# EasyEDA Pro project ProPrj_girlday5_2026-02-15.epro

# Schematic Schematic2
Board Name: SimonSays2; Create Date: 2026-01-21; Page Name: P1; Project Name: girlday5; Schematic Name: Schematic2; Update Date: 2026-01-21; Company: EasyEDA.com; Page Size: A4; Version: V1.0
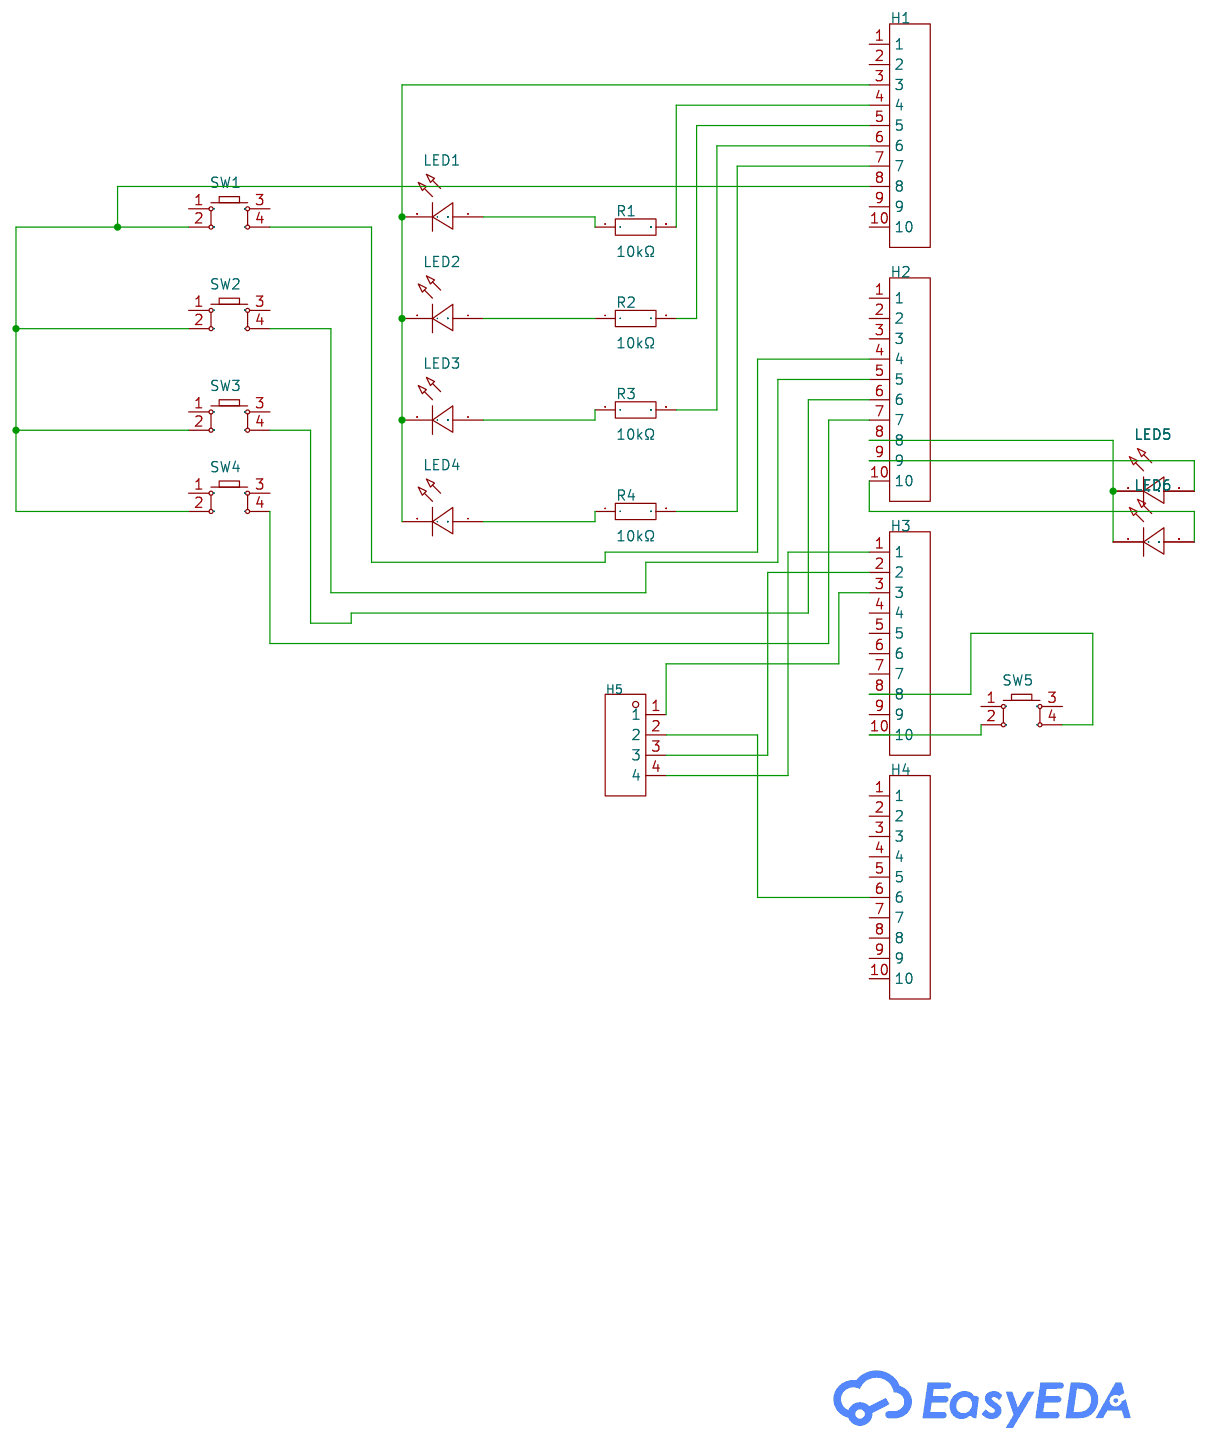
[diagram p0: schematic sheet]

## Parts
H1  -  [HDR-TH_10P-P2.54-V-F]
H2  -  [HDR-TH_10P-P2.54-V-F]
H3  -  [HDR-TH_10P-P2.54-V-F]
H4  -  [HDR-TH_10P-P2.54-V-F]
H5  -  [HDR-TH_4P-P2.54-V-F]
LED1  -  [LED-TH_BD5.8-P2.54-FD]
LED2  -  [LED-TH_BD5.8-P2.54-FD]
LED3  -  [LED-TH_BD5.8-P2.54-FD]
LED4  -  [LED-TH_BD5.8-P2.54-FD]
LED5  -  [LED-TH_BD5.8-P2.54-RD]
LED6  -  [LED-TH_BD5.8-P2.54-RD]
R1  10kΩ  [R_AXIAL-0.4]
R2  10kΩ  [R_AXIAL-0.4]
R3  10kΩ  [R_AXIAL-0.4]
R4  10kΩ  [R_AXIAL-0.4]
SW1  -  [KEY-TH_4P-L6.0-W6.0-P3.90-LS6.5]
SW2  -  [KEY-TH_4P-L6.0-W6.0-P3.90-LS6.5]
SW3  -  [KEY-TH_4P-L6.0-W6.0-P3.90-LS6.5]
SW4  -  [KEY-TH_4P-L6.0-W6.0-P3.90-LS6.5]
SW5  -  [KEY-TH_4P-L6.0-W6.0-P3.90-LS6.5]

## Library data of the parts
H1-H4 = HDR-F_2.54_1x10P: Supplier Footprint: Through
H5 = HDR-F_2.54_1x4P: Supplier Footprint: Through
LED1-LED4 = LED_TH-R_5mm: Supplier Footprint: Through
LED5 LED6 = LED_TH-G_5mm: Supplier Footprint: Through
R1-R4 = Res_AXIAL-1/4W: Supplier Footprint: Through
SW1-SW5 = Key_TH_6x6x4.5: Supplier Footprint: Through

## Nets
$1N1515: LED1.1(C) R1.1
$1N1520: LED2.1(C) R2.1
$1N1525: LED3.1(C) R3.1
$1N1531: LED4.1(C) R4.1
$1N1537: H1.4 R1.2
$1N1543: H1.5 R2.2
$1N1550: H1.6 R3.2
$1N1557: H1.7 R4.2
$1N1576: H2.5 SW2.4
$1N1601: H2.7 SW4.4
$1N1611: H2.4 SW1.4
$1N1619: H2.6 SW3.4
$1N1721: H3.3 H5.1
$1N1740: H3.1 H5.4
$1N1747: H3.2 H5.3
$1N1754: H2.8 LED5.2(A) LED6.2(A)
$1N1761: H2.9 LED5.1(C)
$1N1767: H2.10 LED6.1(C)
$1N1774: H3.10 SW5.2
$1N1779: H3.8 SW5.4
$1N1795: H1.3 LED1.2(A) LED2.2(A) LED3.2(A) LED4.2(A)
$1N2060: H4.6 H5.2
$1N2069: H1.8 SW1.2 SW2.2 SW3.2 SW4.2

Not connected (* = marked no-connect by the designer): H1 1 2 9 10; H2 1 2 3; H3 4 5 6 7 9; H4 1 2 3 4 5 7 8 9 10; SW1 1 3; SW2 1 3; SW3 1 3; SW4 1 3; SW5 1 3

# Board PCB4
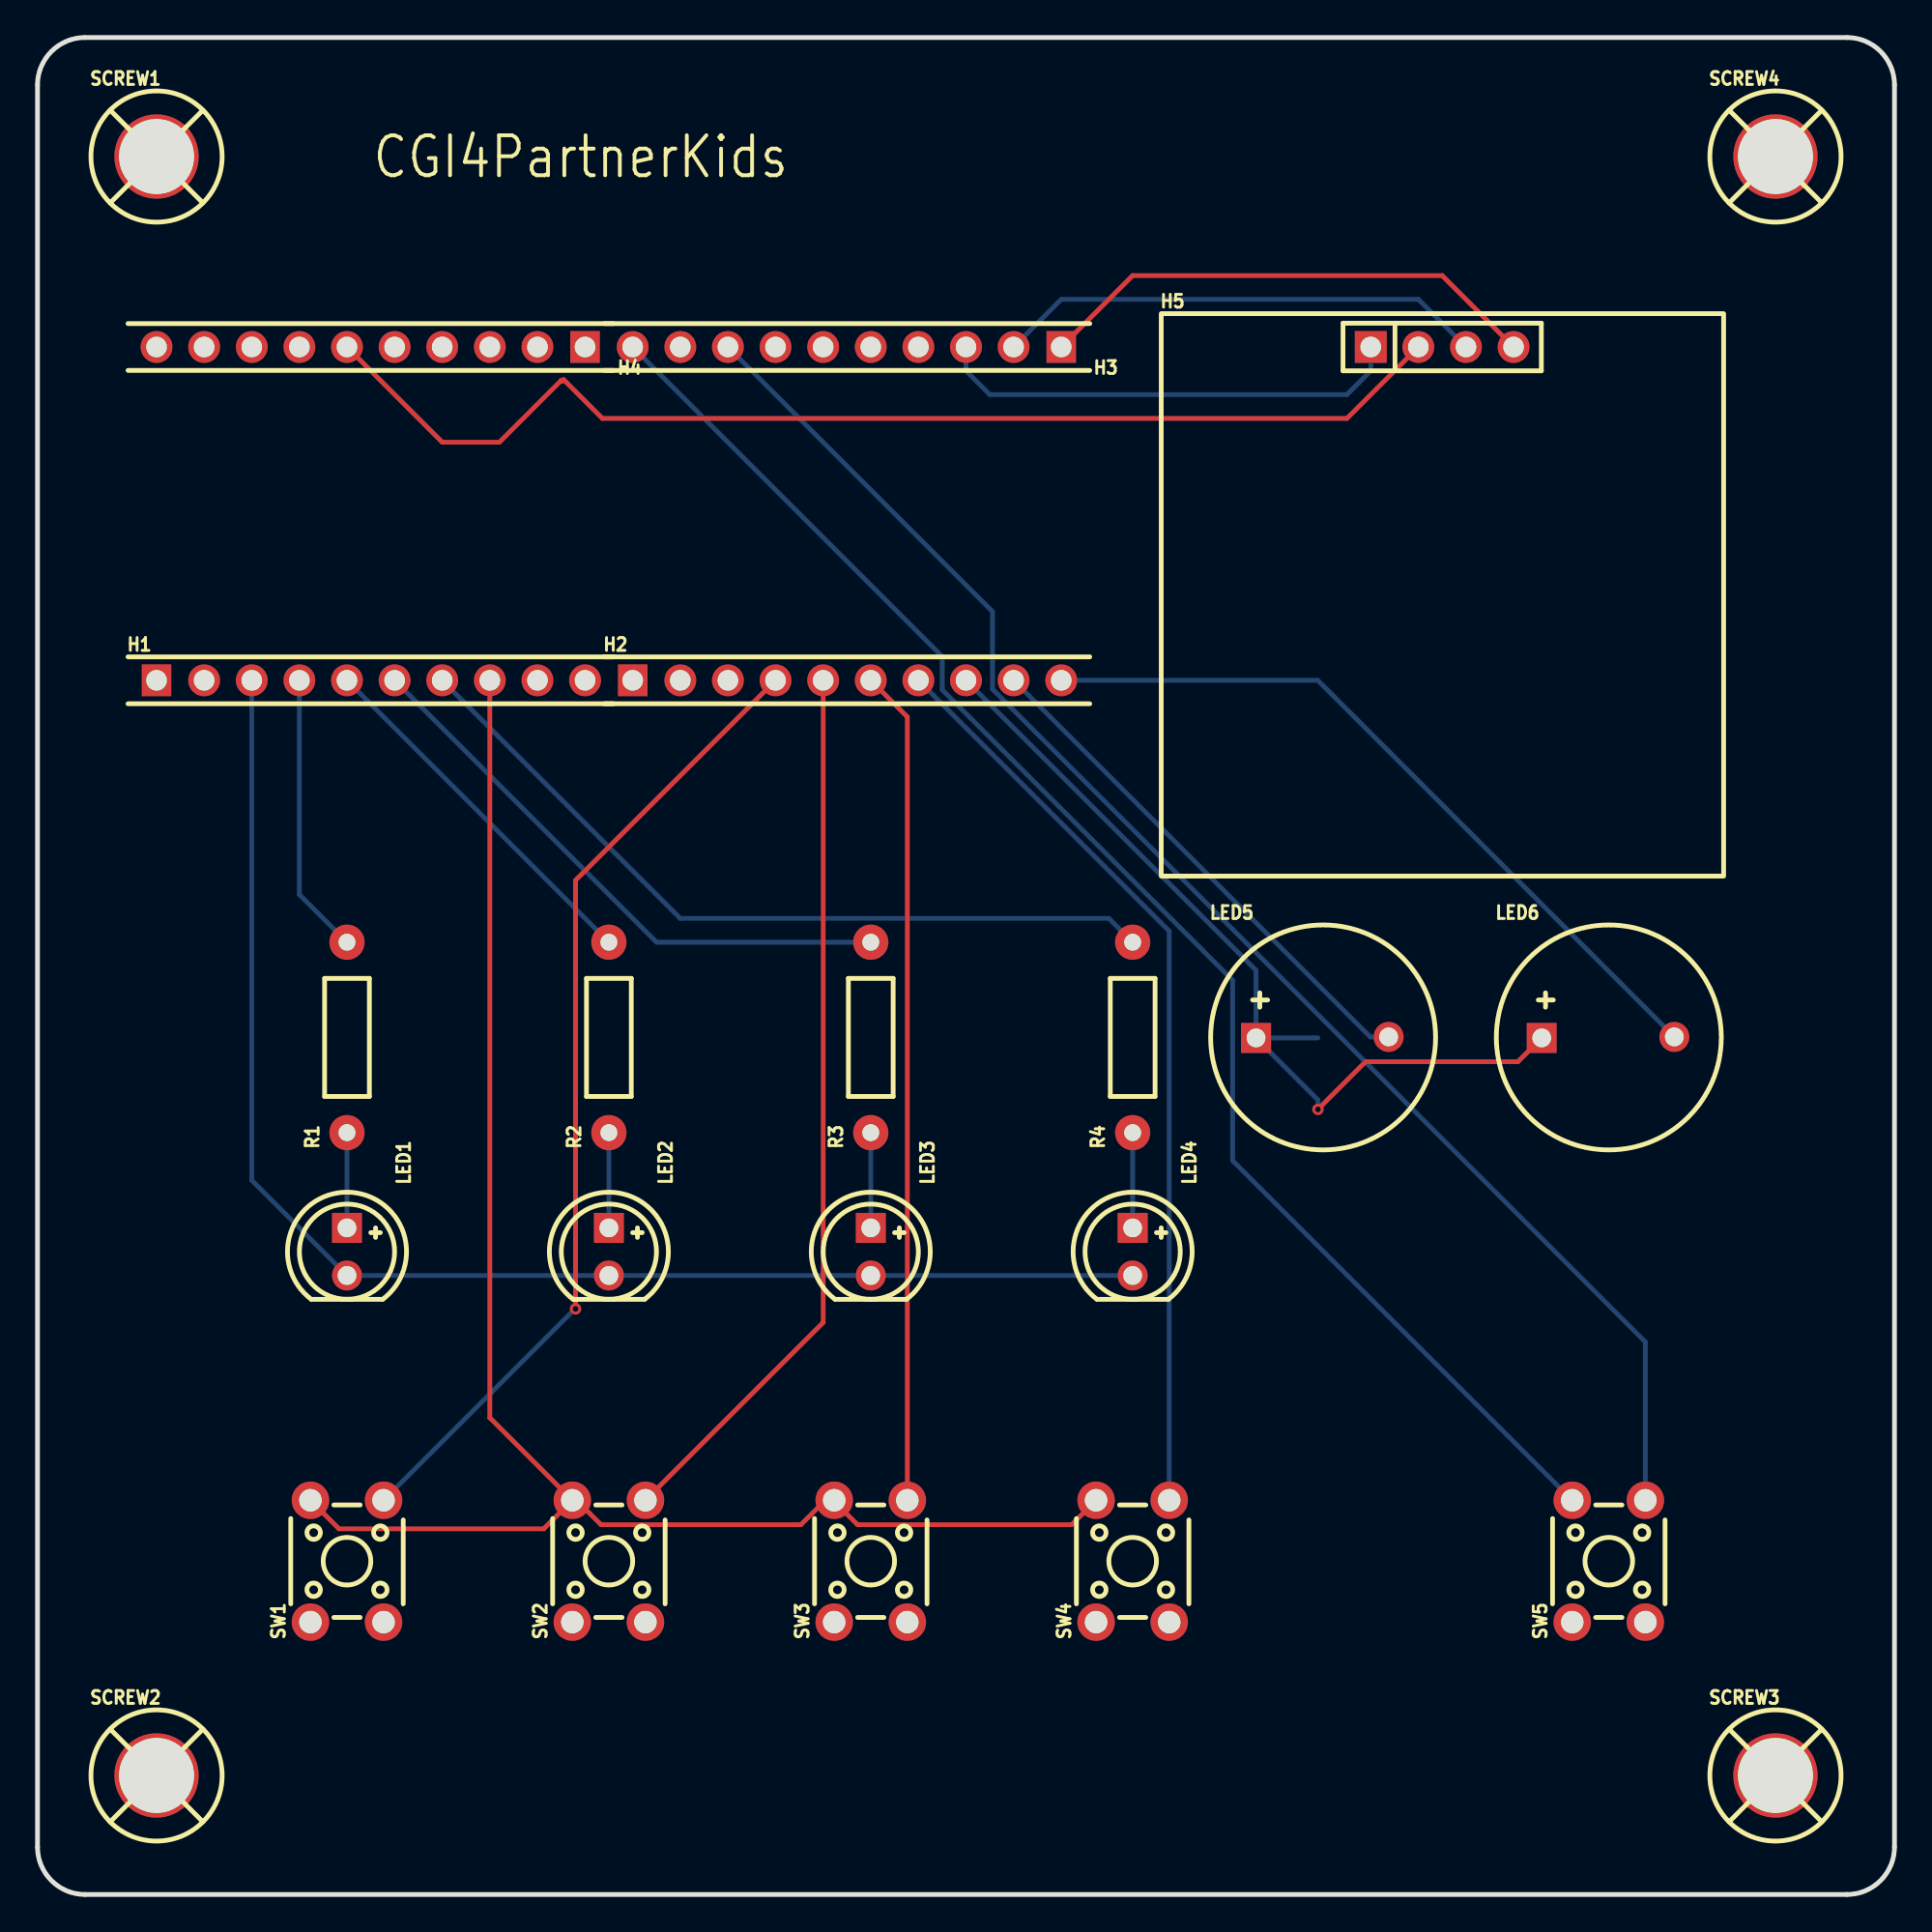
[diagram p1: board, top side]
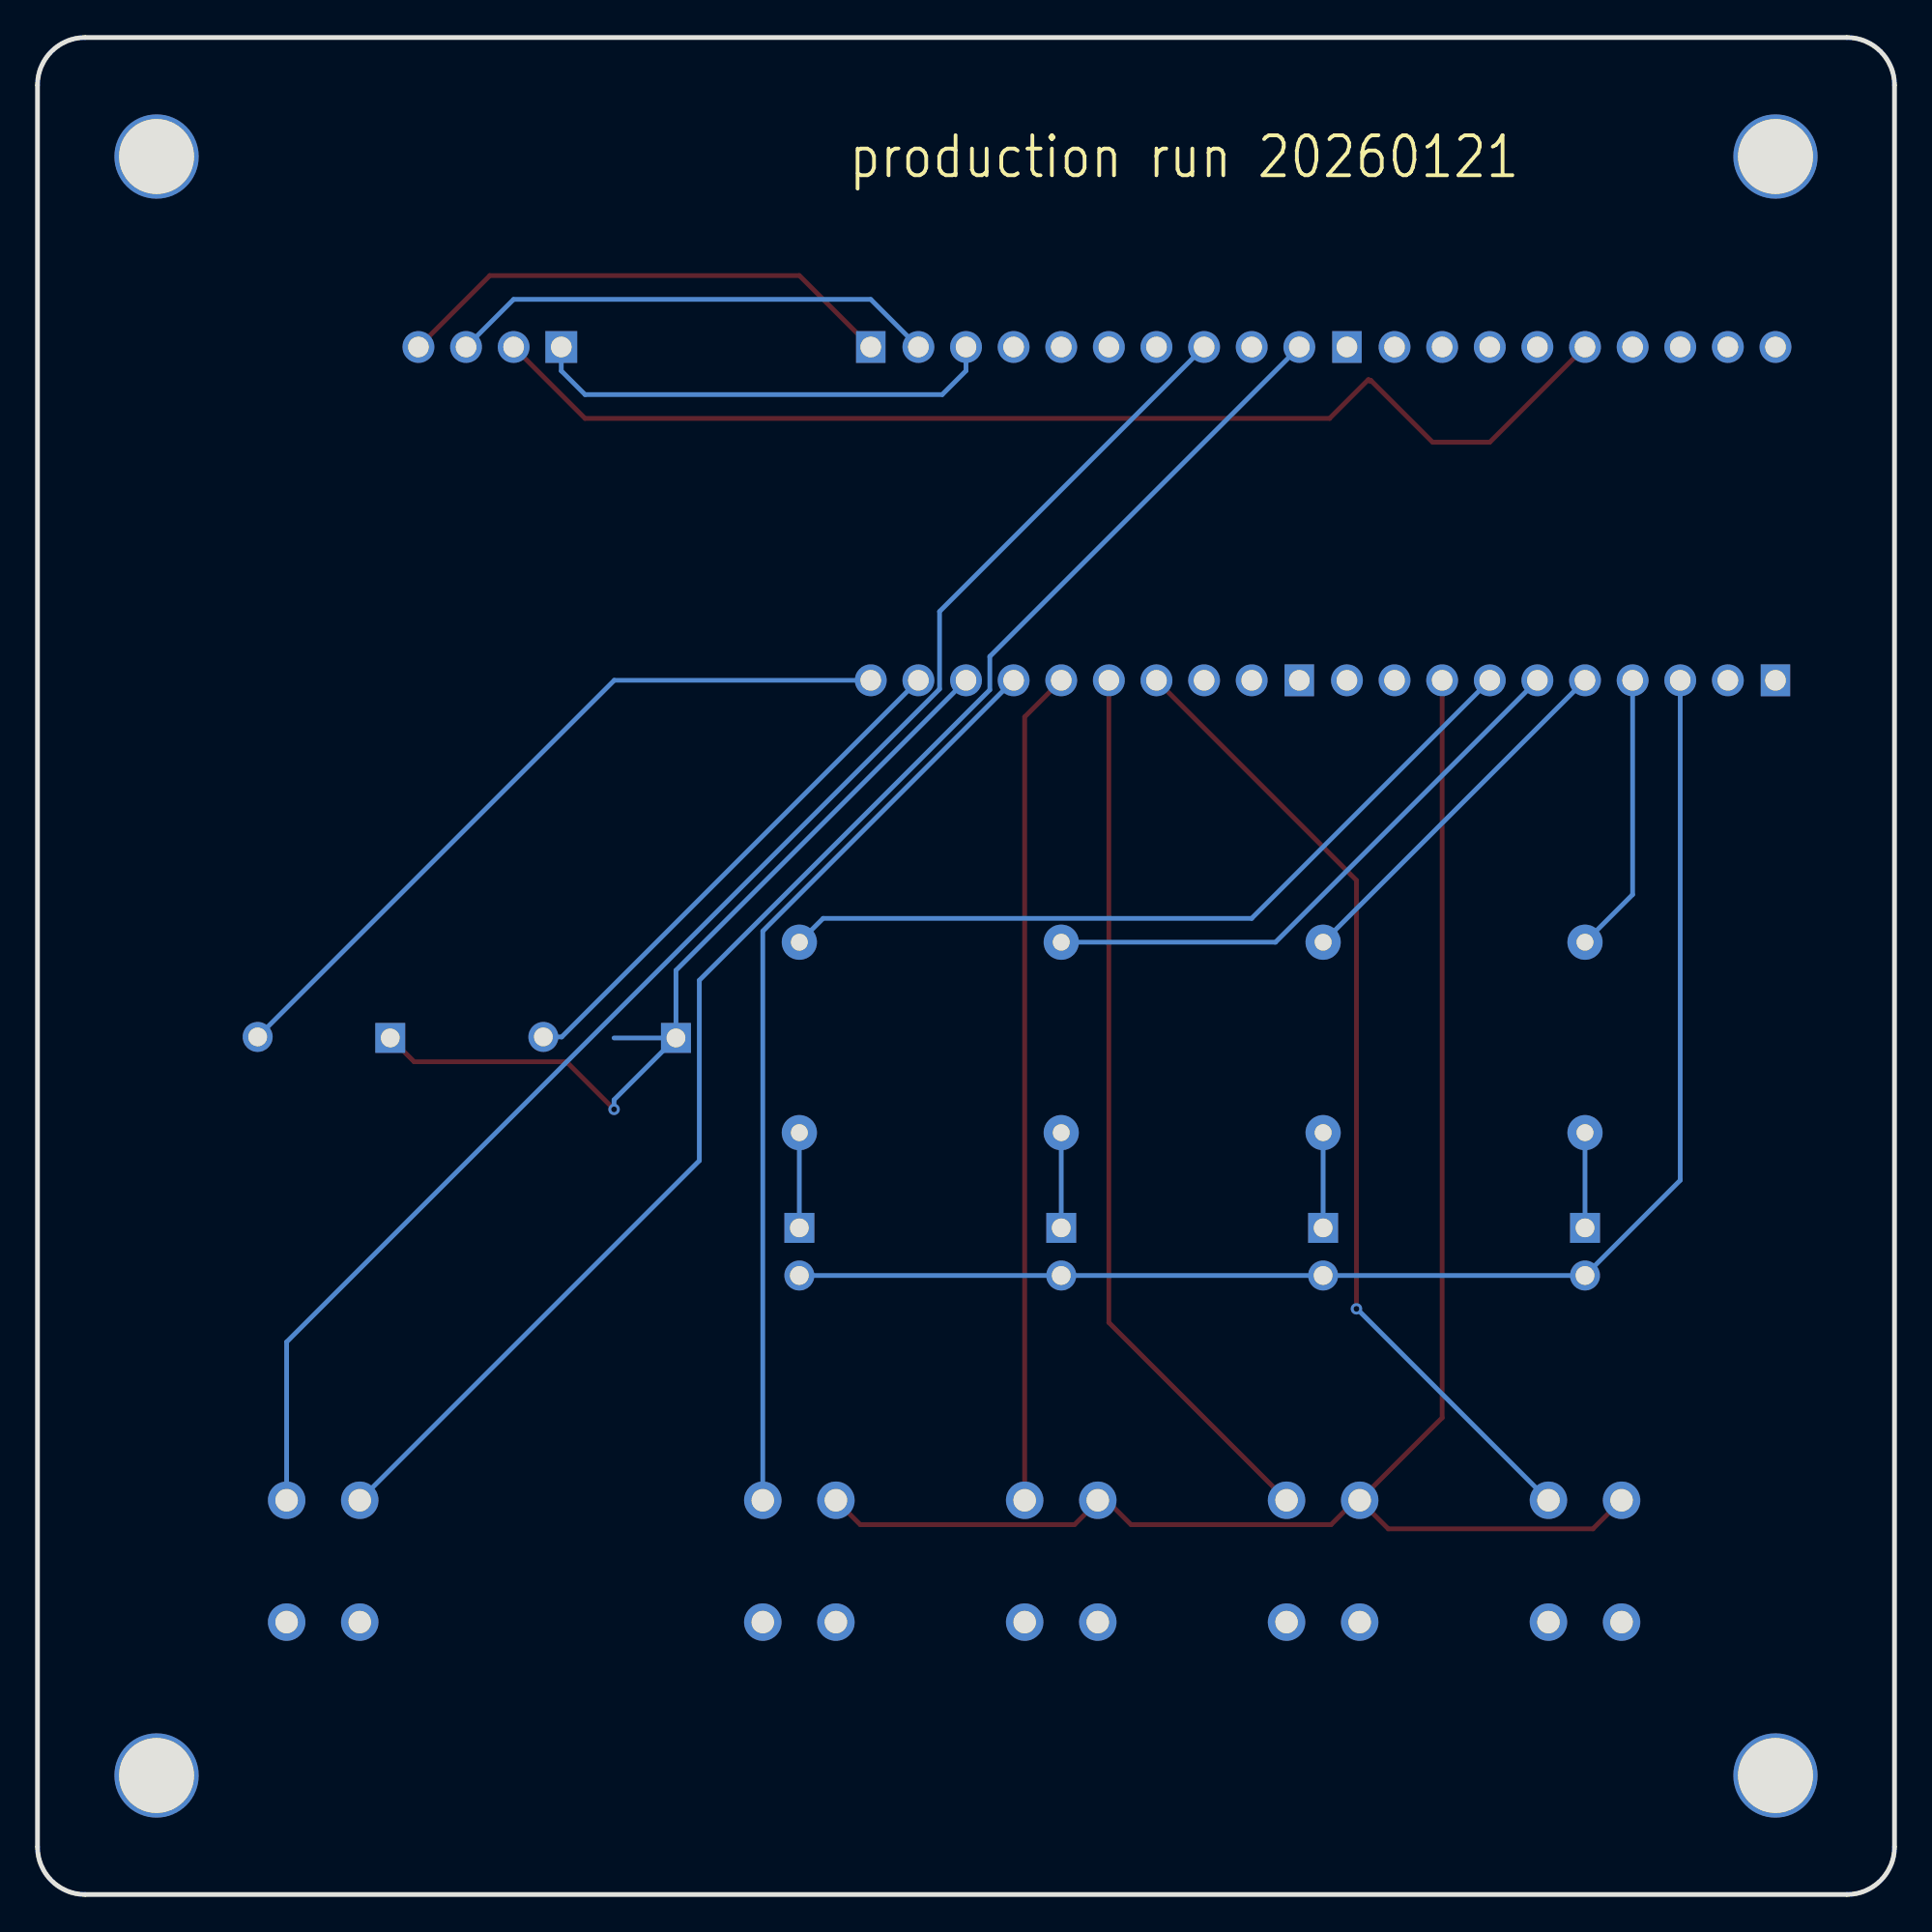
[diagram p2: board, bottom side, seen from below]

Outline 99.06 x 99.06 mm; copper layers: Top Layer, Bottom Layer. Coordinates in mm from the lower left corner of the outline.
Outline path: 0,96.52 0,2.54 arc(0.74,0.74) 2.54,0 96.52,0 arc(98.32,0.74) 99.06,2.54 99.06,96.52 arc(98.32,98.32) 96.52,99.06 2.54,99.06 arc(0.74,98.32) 0,96.52
Stack: Top Layer 0.035mm / Dielectric1 1.51mm FR4 er 4.5 / Bottom Layer 0.035mm

## Design rules (mm)
template: JLCPCB Capability(Two Layers Board)
spacing copperThickness1oz (default): track to track 0.102, other pairs 0.152 to 0.3
spacing copperThickness2oz: track to track 0.203, other pairs 0.152 to 0.3
track width copperThickness1oz (default): min 0.127, default 0.254, max 2.54
track width copperThickness2oz: min 0.203, default 0.254, max 2.54
differential pair differentialPair (default): width min 0.127, default 0.254, max 2.54; gap min 0.152, default 0.152
via viaSize (default): diameter min 0.5, default 0.61, max 10; hole min 0.3, default 0.305, max 6.3

## Placement (name value [footprint] x y rotation side)
H1  -  [HDR-TH_10P-P2.54-V-F]  17.78 64.77 0 top
H2  -  [HDR-TH_10P-P2.54-V-F]  43.18 64.77 0 top
H3  -  [HDR-TH_10P-P2.54-V-F]  43.18 82.55 180 top
H4  -  [HDR-TH_10P-P2.54-V-F]  17.78 82.55 180 top
H5  -  [HDR-TH_4P-P2.54-V-F]  74.93 82.55 0 top
LED1  -  [LED-TH_BD5.8-P2.54-FD]  16.51 34.29 270 top
LED2  -  [LED-TH_BD5.8-P2.54-FD]  30.48 34.29 270 top
LED3  -  [LED-TH_BD5.8-P2.54-FD]  44.45 34.29 270 top
LED4  -  [LED-TH_BD5.8-P2.54-FD]  58.42 34.29 270 top
LED5  -  [LED-TH_BD5.8-P2.54-RD]  68.58 45.72 0 top
LED6  -  [LED-TH_BD5.8-P2.54-RD]  83.82 45.72 0 top
R1  10kΩ  [R_AXIAL-0.4]  16.51 45.72 90 top
R2  10kΩ  [R_AXIAL-0.4]  30.48 45.72 90 top
R3  10kΩ  [R_AXIAL-0.4]  44.45 45.72 90 top
R4  10kΩ  [R_AXIAL-0.4]  58.42 45.72 90 top
SCREW1  -  [Screw-Hole-M4]  6.35 92.71 0 top
SCREW2  -  [Screw-Hole-M4]  6.35 6.35 0 top
SCREW3  -  [Screw-Hole-M4]  92.71 6.35 0 top
SCREW4  -  [Screw-Hole-M4]  92.71 92.71 0 top
SW1  -  [KEY-TH_4P-L6.0-W6.0-P3.90-LS6.5]  16.51 17.78 90 top
SW2  -  [KEY-TH_4P-L6.0-W6.0-P3.90-LS6.5]  30.48 17.78 90 top
SW3  -  [KEY-TH_4P-L6.0-W6.0-P3.90-LS6.5]  44.45 17.78 90 top
SW4  -  [KEY-TH_4P-L6.0-W6.0-P3.90-LS6.5]  58.42 17.78 90 top
SW5  -  [KEY-TH_4P-L6.0-W6.0-P3.90-LS6.5]  83.82 17.78 90 top

## Footprints (pads in the part's own frame, mm; a bottom-side part is the same pattern mirrored in y, then rotated)
HDR-TH_4P-P2.54-V-F
  rect 1.7x1.7 hole 1.1: 1(-3.81,0)
  round 1.7 hole 1.1: 2(-1.27,0) 3(1.27,0) 4(3.81,0)
HDR-TH_10P-P2.54-V-F
  rect 1.575x1.7 hole 1.1: 1(-11.43,0)
  round 1.7 hole 1.1: 2(-8.89,0) 3(-6.35,0) 4(-3.81,0) 5(-1.27,0) 6(1.27,0) 7(3.81,0) 8(6.35,0) 9(8.89,0) 10(11.43,0)
KEY-TH_4P-L6.0-W6.0-P3.90-LS6.5
  round 2 hole 1.2: 1(-3.25,1.95) 2(3.25,1.95) 3(-3.25,-1.95) 4(3.25,-1.95)
LED-TH_BD5.8-P2.54-FD
  rect 1.6x1.6 hole 1: 1(-1.27,0)
  round 1.6 hole 1: 2(1.27,0)
LED-TH_BD5.8-P2.54-RD
  round 1.6 hole 1: 1(3.495,0.027)
  rect 1.6x1.6 hole 1: 2(-3.578,-0.028)
R_AXIAL-0.4
  round 1.879 hole 0.899: 1(-5.08,0) 2(5.08,0)
Screw-Hole-M4
  round 4.5 hole 4: 1(0,0)

## Nets
As in the schematic.

Pads without a net: H1 1 2 9 10; H2 1 2 3; H3 4 5 6 7 9; H4 1 2 3 4 5 7 8 9 10; SCREW1 1; SCREW2 1; SCREW3 1; SCREW4 1; SW1 1 3; SW2 1 3; SW3 1 3; SW4 1 3; SW5 1 3

## Via types
v1: diameter 0.61, hole 0.305, Top Layer to Bottom Layer, 2 vias

## Routing (per net, layer and track width the routed paths; a pad name or vN(x,y) marks a point on that pad's centre or on a via; arc(x,y) is an arc through that point)
$1N1515: length 5.1
  Bottom Layer w0.254: LED1.1 R1.1
$1N1520: length 5.1
  Bottom Layer w0.254: LED2.1 R2.1
$1N1525: length 5.1
  Bottom Layer w0.254: LED3.1 R3.1
$1N1531: length 5.1
  Bottom Layer w0.254: LED4.1 R4.1
$1N1537: length 15
  Bottom Layer w0.254: H1.4 13.97,53.34 R1.2
$1N1543: length 19.8
  Bottom Layer w0.254: H1.5 R2.2
$1N1550: length 31.2
  Bottom Layer w0.254: R3.2 33.02,50.8 H1.6
$1N1557: length 42.6
  Bottom Layer w0.254: R4.2 57.15,52.07 34.29,52.07 H1.7
$1N1576: length 47.7
  Top Layer w0.254: SW2.4 41.91,30.51 H2.5
$1N1601: length 49.3
  Bottom Layer w0.254: SW4.4 60.37,51.39 H2.7
$1N1611: length 52.4
  Top Layer w0.254: H2.4 28.7,54.1 v1(28.7,31.24)
  Bottom Layer w0.254: SW1.4 28.67,31.24 v1(28.7,31.24)
$1N1619: length 44.5
  Top Layer w0.254: SW3.4 46.4,62.82 H2.6
$1N1721: length 25.2
  Bottom Layer w0.254: H3.3 49.53,81.28 50.8,80.01 69.85,80.01 71.12,81.28 H5.1
$1N1740: length 27.3
  Top Layer w0.254: H5.4 74.93,86.36 58.42,86.36 H3.1
$1N1747: length 26.2
  Bottom Layer w0.254: H5.3 73.66,85.09 54.61,85.09 H3.2
$1N1754: length 47.5
  Top Layer w0.254: v1(68.3,41.88) 70.84,44.42 78.97,44.42 LED6.2
  Bottom Layer w0.254: v1(68.3,41.88) 68.3,42.39 LED5.2 ; LED5.2 68.3,45.69 ; LED5.2 65,49.3 H2.8
$1N1761: length 27.9
  Bottom Layer w0.254: H2.9 71.09,45.75 LED5.1
$1N1767: length 40.6
  Bottom Layer w0.254: H2.10 68.29,64.77 LED6.1
$1N1774: length 82.3
  Bottom Layer w0.254: H3.10 48.26,66.04 48.26,64.26 63.75,48.77 63.75,39.15 SW5.2
$1N1779: length 81.8
  Bottom Layer w0.254: H3.8 50.94,68.44 50.94,64.3 85.77,29.47 SW5.4
$1N1795: length 75.8
  Bottom Layer w0.254: LED4.2 LED3.2 LED2.2 LED1.2 11.43,38.1 H1.3
$1N2060: length 63.1
  Top Layer w0.254: H5.2 69.85,78.74 30.14,78.74 28.06,80.81 27.98,80.73 27.94,80.77 24.64,77.47 21.59,77.47 H4.6
$1N2069: length 91.2
  Top Layer w0.254: SW2.2 28.53,21.25 30.05,19.73 40.72,19.73 41.99,21 42.47,21 ; SW2.2 27.01,19.51 16.08,19.51 SW1.2 ; SW2.2 24.13,25.43 H1.8 ; SW4.2 55.17,19.73 43.74,19.73 42.47,21 ; 42.47,21 SW3.2

## Text on the board
Bottom Silkscreen Layer: production run 20260121
Top Silkscreen Layer: CGI4PartnerKids

# Board PCB3
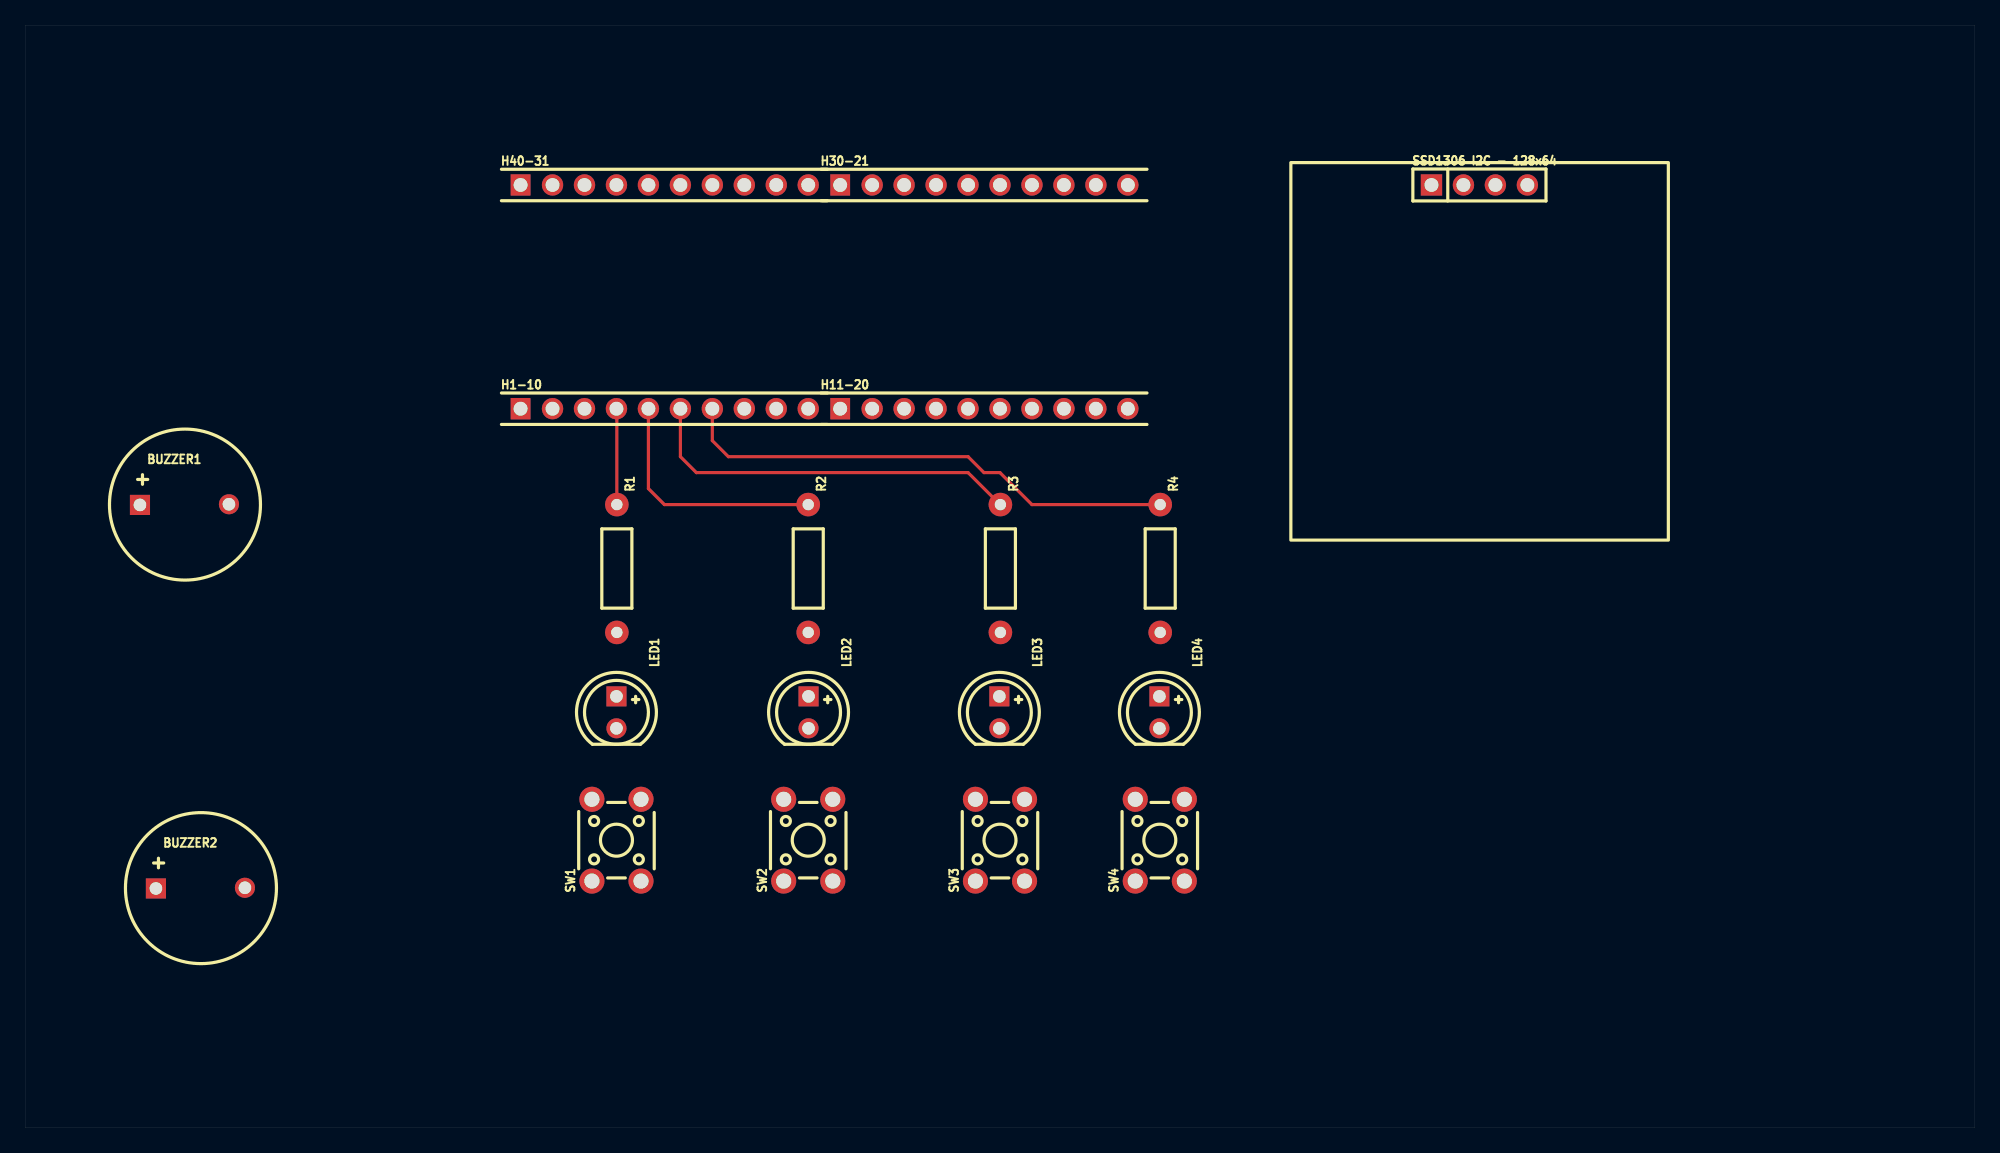
[diagram p3: board, top side]
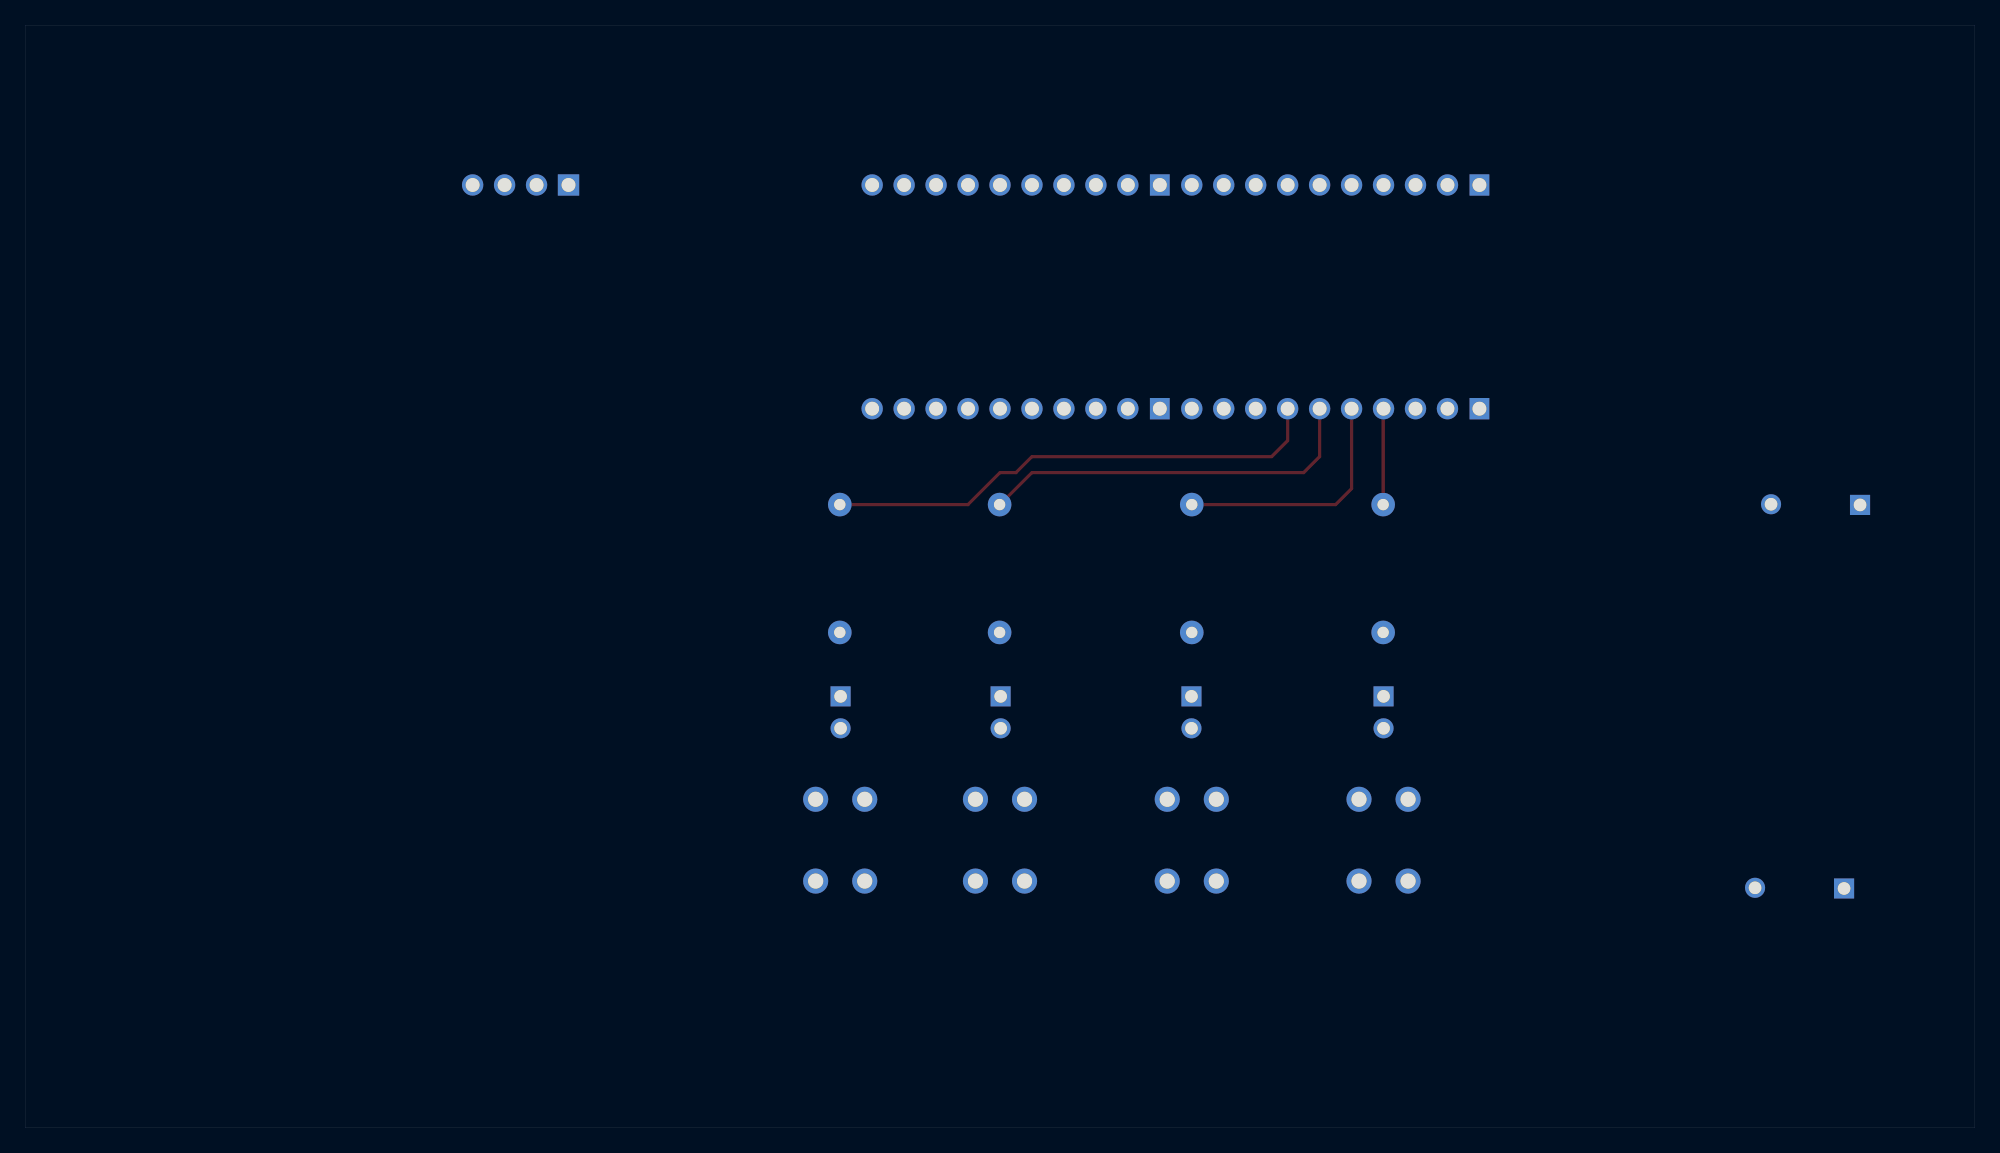
[diagram p4: board, bottom side, seen from below]

Outline 154.94 x 87.63 mm; copper layers: Top Layer, Bottom Layer. Coordinates in mm from the lower left corner of the outline.
Outline path: rectangle 0,87.63 154.94,0
Stack: Top Layer 0.035mm / Dielectric1 1.51mm FR4 er 4.5 / Bottom Layer 0.035mm

## Design rules (mm)
template: JLCPCB Capability(Two Layers Board)
spacing copperThickness1oz (default): track to track 0.102, other pairs 0.152 to 0.3
spacing copperThickness2oz: track to track 0.203, other pairs 0.152 to 0.3
track width copperThickness1oz (default): min 0.127, default 0.254, max 2.54
track width copperThickness2oz: min 0.203, default 0.254, max 2.54
differential pair differentialPair (default): width min 0.127, default 0.254, max 2.54; gap min 0.152, default 0.152
via viaSize (default): diameter min 0.5, default 0.61, max 10; hole min 0.3, default 0.305, max 6.3

## Placement (name value [footprint] x y rotation side)
BUZZER1  -  [LED-TH_BD5.8-P2.54-RD]  12.7 49.53 0 top
BUZZER2  -  [LED-TH_BD5.8-P2.54-RD]  13.97 19.05 0 top
H1-10  -  [HDR-TH_10P-P2.54-V-F]  50.8 57.15 0 top
H11-20  -  [HDR-TH_10P-P2.54-V-F]  76.2 57.15 0 top
H30-21  -  [HDR-TH_10P-P2.54-V-F]  76.2 74.93 0 top
H40-31  -  [HDR-TH_10P-P2.54-V-F]  50.8 74.93 0 top
LED1  -  [LED-TH_BD5.8-P2.54-FD]  46.99 33.02 270 top
LED2  -  [LED-TH_BD5.8-P2.54-FD]  62.26 33.02 270 top
LED3  -  [LED-TH_BD5.8-P2.54-FD]  77.42 33.02 270 top
LED4  -  [LED-TH_BD5.8-P2.54-FD]  90.14 33.02 270 top
R1  10kΩ  [R_AXIAL-0.4]  47.02 44.45 270 top
R2  10kΩ  [R_AXIAL-0.4]  62.23 44.45 270 top
R3  10kΩ  [R_AXIAL-0.4]  77.5 44.45 270 top
R4  10kΩ  [R_AXIAL-0.4]  90.2 44.45 270 top
SSD1306 I2C - 128x64  -  [HDR-TH_4P-P2.54-V-F]  115.57 74.93 0 top
SW1  -  [KEY-TH_4P-L6.0-W6.0-P3.90-LS6.5]  46.99 22.86 90 top
SW2  -  [KEY-TH_4P-L6.0-W6.0-P3.90-LS6.5]  62.23 22.86 90 top
SW3  -  [KEY-TH_4P-L6.0-W6.0-P3.90-LS6.5]  77.47 22.86 90 top
SW4  -  [KEY-TH_4P-L6.0-W6.0-P3.90-LS6.5]  90.17 22.86 90 top

## Footprints (pads in the part's own frame, mm; a bottom-side part is the same pattern mirrored in y, then rotated)
HDR-TH_4P-P2.54-V-F
  rect 1.7x1.7 hole 1.1: 1(-3.81,0)
  round 1.7 hole 1.1: 2(-1.27,0) 3(1.27,0) 4(3.81,0)
HDR-TH_10P-P2.54-V-F
  rect 1.575x1.7 hole 1.1: 1(-11.43,0)
  round 1.7 hole 1.1: 2(-8.89,0) 3(-6.35,0) 4(-3.81,0) 5(-1.27,0) 6(1.27,0) 7(3.81,0) 8(6.35,0) 9(8.89,0) 10(11.43,0)
KEY-TH_4P-L6.0-W6.0-P3.90-LS6.5
  round 2 hole 1.2: 1(-3.25,1.95) 2(3.25,1.95) 3(-3.25,-1.95) 4(3.25,-1.95)
LED-TH_BD5.8-P2.54-FD
  rect 1.6x1.6 hole 1: 1(-1.27,0)
  round 1.6 hole 1: 2(1.27,0)
LED-TH_BD5.8-P2.54-RD
  round 1.6 hole 1: 1(3.495,0.027)
  rect 1.6x1.6 hole 1: 2(-3.578,-0.028)
R_AXIAL-0.4
  round 1.879 hole 0.899: 1(-5.08,0) 2(5.08,0)

## Nets

Pads without a net: BUZZER1 1 2; BUZZER2 1 2; H1-10 1 2 3 4 5 6 7 8 9 10; H11-20 1 2 3 4 5 6 7 8 9 10; H30-21 1 2 3 4 5 6 7 8 9 10; H40-31 1 2 3 4 5 6 7 8 9 10; LED1 1 2; LED2 1 2; LED3 1 2; LED4 1 2; R1 1 2; R2 1 2; R3 1 2; R4 1 2; SSD1306 I2C - 128x64 1 2 3 4; SW1 1 2 3 4; SW2 1 2 3 4; SW3 1 2 3 4; SW4 1 2 3 4

## Routing (per net, layer and track width the routed paths; a pad name or vN(x,y) marks a point on that pad's centre or on a via; arc(x,y) is an arc through that point)
(no net): length 98.3
  Top Layer w0.254: H1-10.4 47.02,57.12 R1.1 ; H1-10.6 52.07,53.34 53.34,52.07 74.93,52.07 77.47,49.53 R3.1 ; R4.1 80.01,49.53 77.47,52.07 76.2,52.07 74.93,53.34 55.88,53.34 54.61,54.61 H1-10.7 ; R2.1 50.8,49.53 49.53,50.8 H1-10.5
